# EAGLE design M129X (EAGLE 6.6.0)
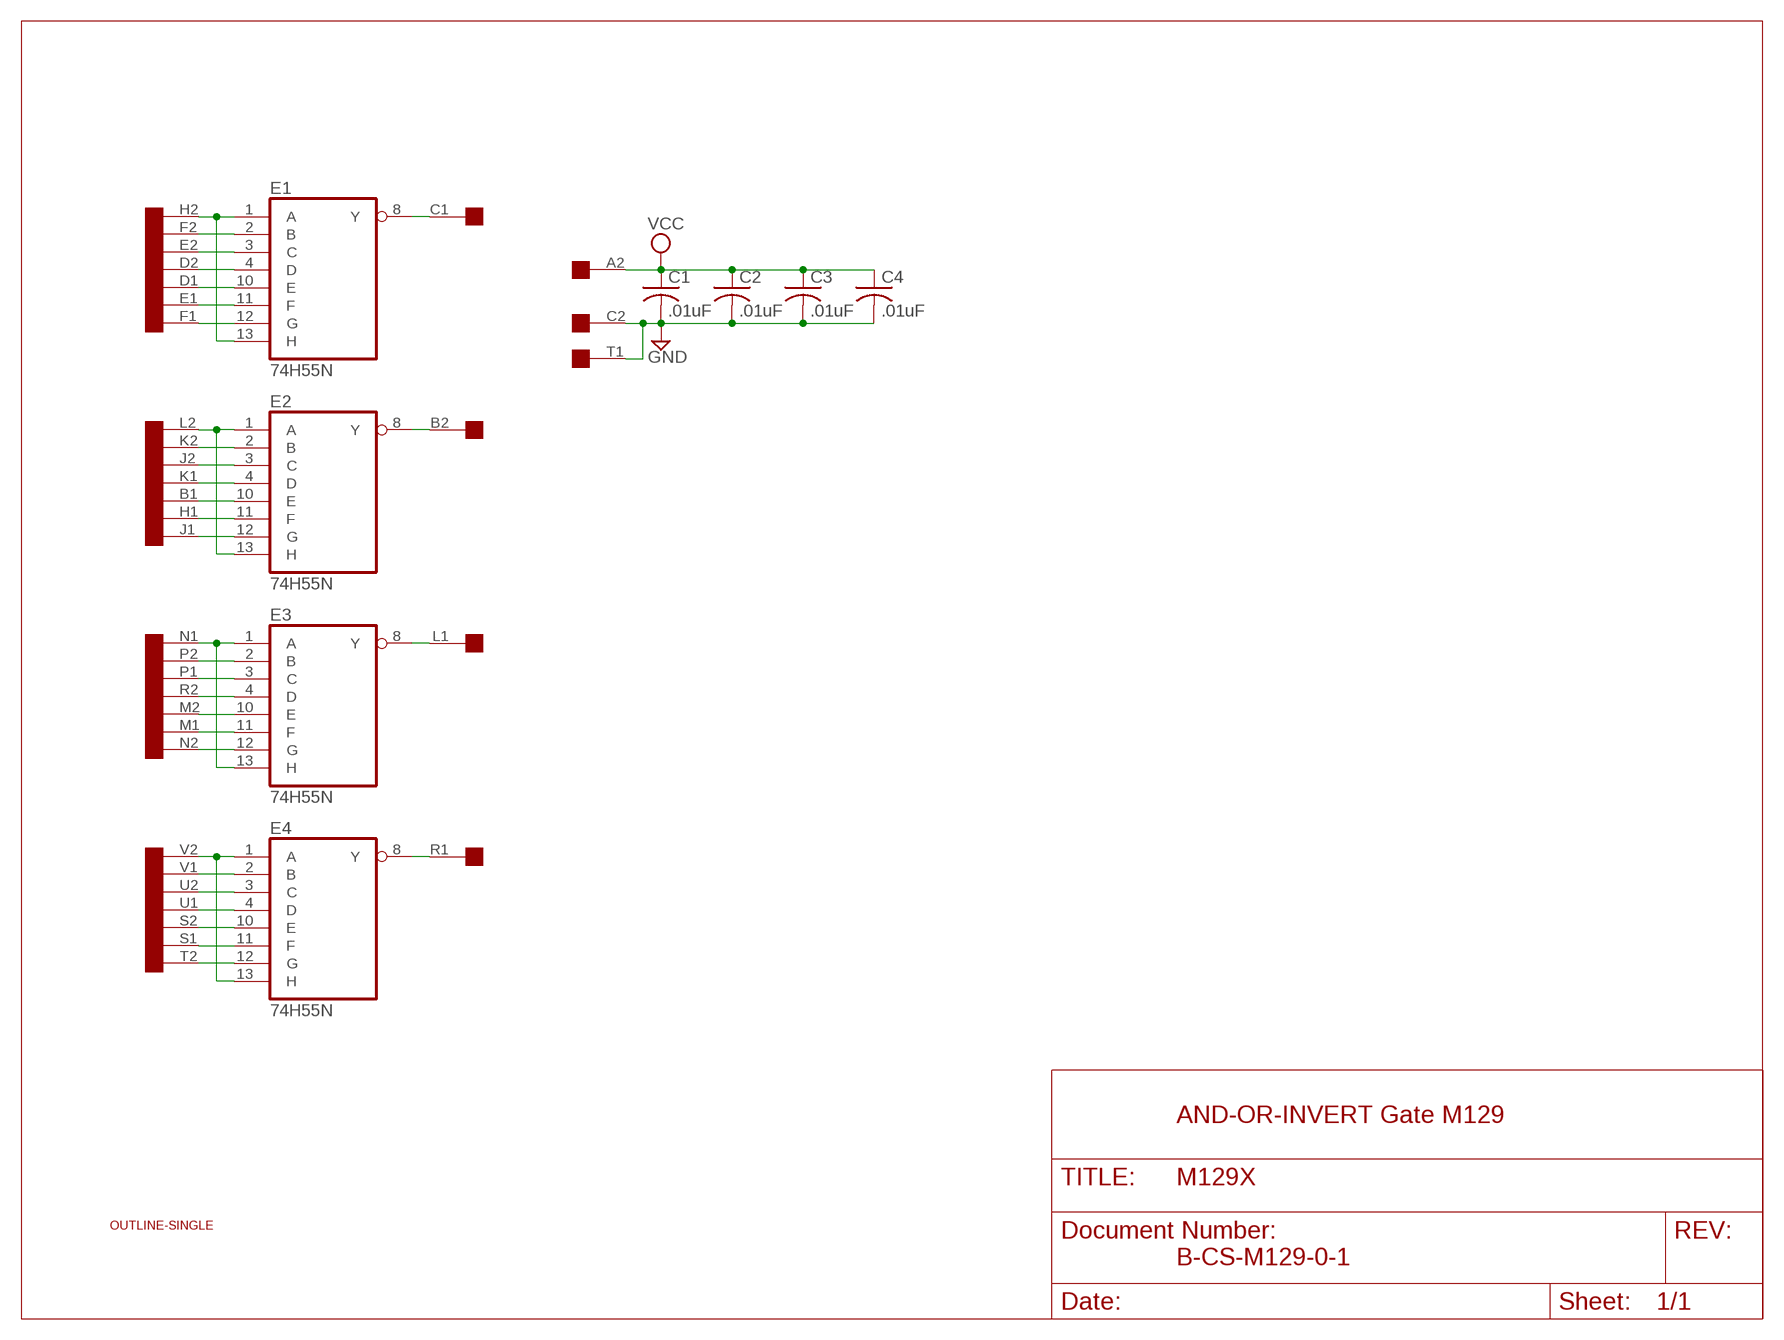
[diagram p0: schematic, sheet 1]

## Parts
C1  .01uF  C-US050-025X075  [C050-025X075]
C2  .01uF  C-US050-025X075  [C050-025X075]
C3  .01uF  C-US050-025X075  [C050-025X075]
C4  .01uF  C-US050-025X075  [C050-025X075]
E1  74H55N  74LS55N  [DIL14]
E2  74H55N  74LS55N  [DIL14]
E3  74H55N  74LS55N  [DIL14]
E4  74H55N  74LS55N  [DIL14]
U$1  SINGLE  [EDGE-CON2]
U$2  OUTLINE-SINGLE  [SINGLE]

## Nets
B1: E2.10(E) U$1.B1
B2: E2.8(Y) U$1.B2
C1: E1.8(Y) U$1.C1
D1: E1.10(E) U$1.D1
D2: E1.4(D) U$1.D2
E1: E1.11(F) U$1.E1
E2: E1.3(C) U$1.E2
F1: E1.12(G) U$1.F1
F2: E1.2(B) U$1.F2
GND: C1.2 C2.2 C3.2 C4.2 U$1.C2 U$1.T1
H1: E2.11(F) U$1.H1
H2: E1.1(A) E1.13(H) U$1.H2
J1: E2.12(G) U$1.J1
J2: E2.3(C) U$1.J2
K1: E2.4(D) U$1.K1
K2: E2.2(B) U$1.K2
L1: E3.8(Y) U$1.L1
L2: E2.1(A) E2.13(H) U$1.L2
M1: E3.11(F) U$1.M1
M2: E3.10(E) U$1.M2
N1: E3.1(A) E3.13(H) U$1.N1
N2: E3.12(G) U$1.N2
P1: E3.3(C) U$1.P1
P2: E3.2(B) U$1.P2
R1: E4.8(Y) U$1.R1
R2: E3.4(D) U$1.R2
S1: E4.11(F) U$1.S1
S2: E4.10(E) U$1.S2
T2: E4.12(G) U$1.T2
U1: E4.4(D) U$1.U1
U2: E4.3(C) U$1.U2
V1: E4.2(B) U$1.V1
V2: E4.1(A) E4.13(H) U$1.V2
VCC: C1.1 C2.1 C3.1 C4.1 U$1.A2
Unconnected: U$1.A1

## Notes on the sheet
- AND-OR-INVERT Gate M129
- B-CS-M129-0-1

## Power pins joined to a net without a drawn wire
GND: E1.7(GND) E2.7(GND) E3.7(GND) E4.7(GND)
VCC: E1.14(VCC) E2.14(VCC) E3.14(VCC) E4.14(VCC)

## Library data of the parts
C1-C4 = rcl:C-US: CAPACITOR, American symbol
E1-E4 = 74xx-us:74*55: 2-wide 4-input AND OR INVERTER gate
U$1 = dec-con:SINGLE: Single-Height DEC board
U$2 = dec-con:OUTLINE-*: Board outlines for DEC boards.

## Net classes
0 default: width 0.813 mm

## Board
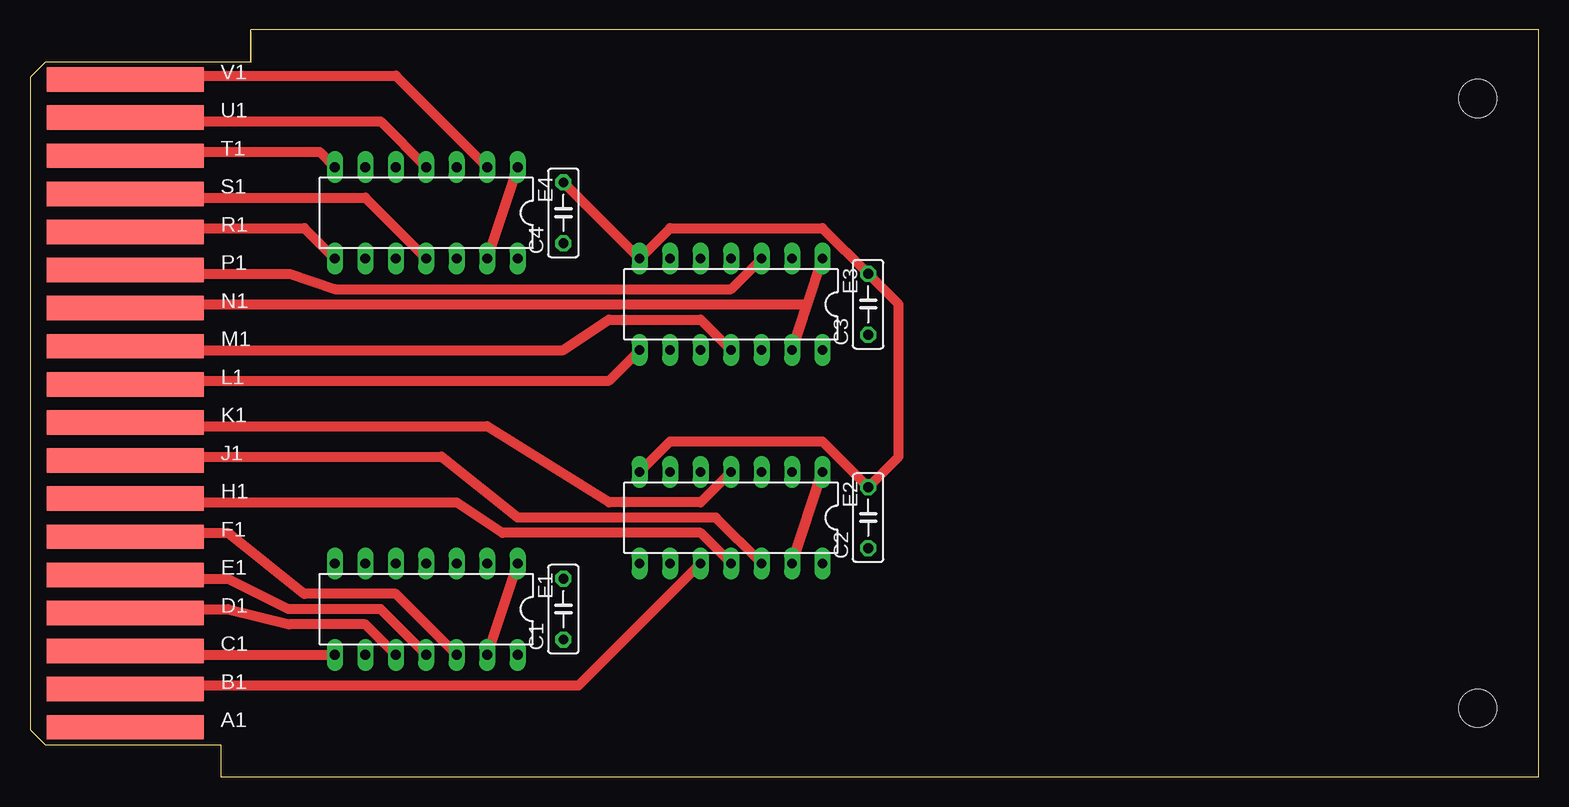
[diagram p1: board, top side]
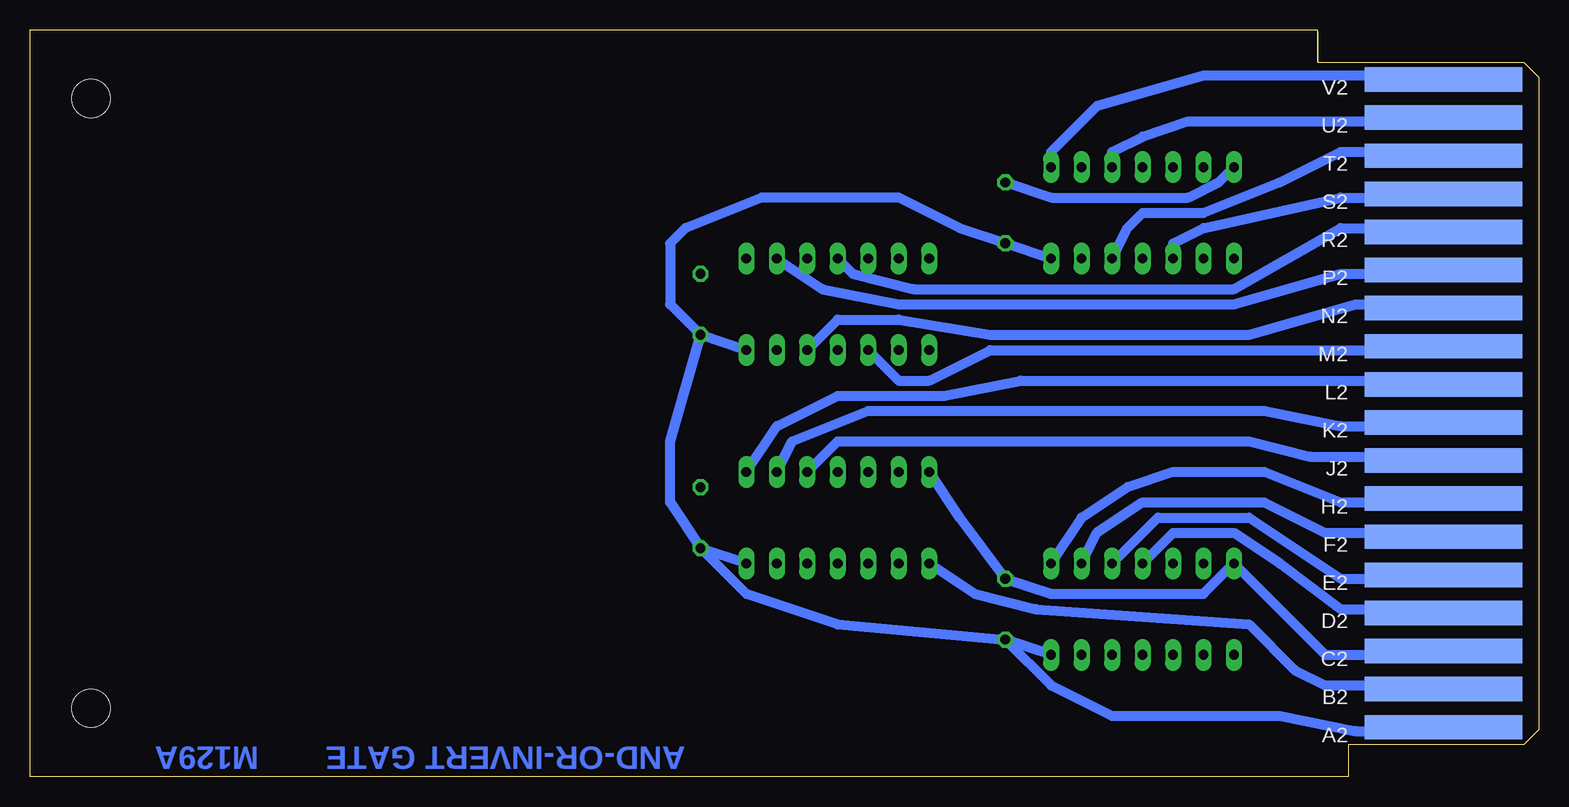
[diagram p2: board, bottom side, seen from below]

Size 125.73 x 62.23 mm. Coordinates in mm from the lower left corner, seen from the top.
Copper layers (1+16): Top 0.035mm / dielectric 1.5mm / Bottom 0.035mm
Design rules "16mils": minimum track width 16mil, minimum drill 32mil, track to track 15mil, track to pad 10mil, pad to pad 10mil, via to via 10mil, smd to smd 10mil, copper to edge 13mil, drill to drill 10mil, minimum pad ring 10mil, minimum via ring 8mil, stop-mask expansion 0mil, vias tented up to drill 0mil, thermal gap 10mil

### Footprints (pad centres in the part's own frame; a part is rotated, then mirrored left to right if it is on the bottom)
C050-025X075 = drill 0.813 octagon: 1 -2.54,0; 2 2.54,0
DIL14 = drill 0.813 long: 1 -7.62,-3.81; 2 -5.08,-3.81; 3 -2.54,-3.81; 4 0,-3.81; 5 2.54,-3.81; 6 5.08,-3.81; 7 7.62,-3.81; 8 7.62,3.81; 9 5.08,3.81; 10 2.54,3.81; 11 0,3.81; 12 -2.54,3.81; 13 -5.08,3.81; 14 -7.62,3.81
EDGE-CON2 = smd 13.106 x 2.032: A1 7.938,4.128; B1 7.938,7.303; C1 7.938,10.477; D1 7.938,13.652; E1 7.938,16.828; F1 7.938,20.003; H1 7.938,23.177; J1 7.938,26.352; K1 7.938,29.527; L1 7.938,32.703; M1 7.938,35.877; N1 7.938,39.053; P1 7.938,42.227; R1 7.938,45.403; S1 7.938,48.578; T1 7.938,51.752; U1 7.938,54.928; V1 7.938,58.102 | smd 13.106 x 2.032 bottom: A2 7.938,4.128; B2 7.938,7.303; C2 7.938,10.477; D2 7.938,13.652; E2 7.938,16.828; F2 7.938,20.003; H2 7.938,23.177; J2 7.938,26.352; K2 7.938,29.527; L2 7.938,32.703; M2 7.938,35.877; N2 7.938,39.053; P2 7.938,42.227; R2 7.938,45.403; S2 7.938,48.578; T2 7.938,51.752; U2 7.938,54.928; V2 7.938,58.102
SINGLE = hole 3.175: 120.65,56.515; 120.65,5.715

### Placement (x,y rotation side)
C1  44.45,13.97 90 top
C2  69.85,21.59 90 top
C3  69.85,39.37 90 top
C4  44.45,46.99 90 top
E1  33.02,13.97 180 top
E2  58.42,21.59 180 top
E3  58.42,39.37 180 top
E4  33.02,46.99 180 top
U$1  0,0 0 top
U$2  0,0 0 top

### Tracks (layer width: path | path; a pad name or v marks a point on that pad's centre or on a via)
B1
  Top 0.813: U$1.B1 8.89,7.62 45.72,7.62 E2.10
B2
  Bottom 0.813: E2.8 46.99,15.24 41.91,13.97 24.13,12.7 20.32,8.89 17.78,7.62 8.89,7.62 U$1.B2
C1
  Top 0.813: U$1.C1 7.62,10.16 E1.8
D1
  Top 0.813: E1.10 27.94,12.7 21.59,12.7 16.51,13.97 8.89,13.97 U$1.D1
D2
  Bottom 0.813: E1.4 30.48,20.32 25.4,20.32 21.59,17.78 16.51,13.97 8.89,13.97 U$1.D2
E1
  Top 0.813: E1.11 29.21,13.97 21.59,13.97 16.51,16.51 8.89,16.51 U$1.E1
E2
  Bottom 0.813: E1.3 31.75,21.59 24.13,21.59 16.51,16.51 8.89,16.51 U$1.E2
F1
  Top 0.813: E1.12 30.48,15.24 22.86,15.24 16.51,20.32 10.16,20.32 U$1.F1
F2
  Bottom 0.813: E1.2 36.83,20.32 33.02,22.86 22.86,22.86 17.78,20.32 8.89,20.32 U$1.F2
GND
  Top 0.813: U$1.T1 7.62,52.07 24.13,52.07 E4.7 | C4.2 E3.7 53.34,45.72 66.04,45.72 C3.2 72.39,39.37 72.39,26.67 C2.2 66.04,27.94 53.34,27.94 E2.7
  Bottom 0.813: U$1.C2 8.89,10.16 17.78,10.16 E1.7 27.94,15.24 40.64,15.24 C1.2 48.26,21.59 E2.7 | C4.2 40.64,48.26 29.21,48.26 26.67,49.53 E4.7
H1
  Top 0.813: E2.11 55.88,20.32 39.37,20.32 35.56,22.86 8.89,22.86 U$1.H1
H2
  Top 0.813: E1.13 E1.1
  Bottom 0.813: E1.1 38.1,21.59 34.29,24.13 30.48,25.4 22.86,25.4 16.51,22.86 8.89,22.86 U$1.H2
J1
  Top 0.813: U$1.J1 8.89,26.67 34.29,26.67 40.64,21.59 57.15,21.59 E2.12
J2
  Bottom 0.813: E2.3 58.42,27.94 24.13,27.94 19.05,26.67 8.89,26.67 U$1.J2
K1
  Top 0.813: E2.4 55.88,22.86 48.26,22.86 38.1,29.21 8.89,29.21 U$1.K1
K2
  Bottom 0.813: E2.2 62.23,27.94 55.88,30.48 22.86,30.48 16.51,29.21 8.89,29.21 U$1.K2
L1
  Top 0.813: U$1.L1 10.16,33.02 48.26,33.02 E3.8
L2
  Top 0.813: E2.13 E2.1
  Bottom 0.813: E2.1 63.5,29.21 58.42,31.75 49.53,31.75 43.18,33.02 8.89,33.02 U$1.L2
M1
  Top 0.813: U$1.M1 10.16,35.56 44.45,35.56 48.26,38.1 55.88,38.1 E3.11
M2
  Bottom 0.813: E3.10 53.34,33.02 50.8,33.02 45.72,35.56 8.89,35.56 U$1.M2
N1
  Top 0.813: E3.1 64.77,39.37 | U$1.N1 8.89,39.37 64.77,39.37 | E3.13 64.77,39.37
N2
  Bottom 0.813: E3.12 58.42,38.1 53.34,38.1 45.72,36.83 24.13,36.83 15.24,39.37 8.89,39.37 U$1.N2
P1
  Top 0.813: U$1.P1 7.62,41.91 21.59,41.91 25.4,40.64 58.42,40.64 E3.3
P2
  Bottom 0.813: E3.2 59.69,40.64 53.34,39.37 25.4,39.37 16.51,41.91 8.89,41.91 U$1.P2
R1
  Top 0.813: U$1.R1 8.89,45.72 22.86,45.72 E4.8
R2
  Bottom 0.813: E3.4 57.15,41.91 52.07,40.64 25.4,40.64 16.51,45.72 8.89,45.72 U$1.R2
S1
  Top 0.813: U$1.S1 8.89,48.26 27.94,48.26 E4.11
S2
  Bottom 0.813: E4.10 30.48,44.45 27.94,45.72 16.51,48.26 8.89,48.26 U$1.S2
T2
  Bottom 0.813: E4.12 34.29,45.72 33.02,46.99 27.94,46.99 21.59,49.53 16.51,52.07 8.89,52.07 U$1.T2
U1
  Top 0.813: U$1.U1 8.89,54.61 29.21,54.61 E4.4
U2
  Bottom 0.813: E4.3 35.56,52.07 33.02,53.34 29.21,54.61 8.89,54.61 U$1.U2
V1
  Top 0.813: U$1.V1 8.89,58.42 30.48,58.42 E4.2
V2
  Top 0.813: E4.13 E4.1
  Bottom 0.813: U$1.V2 10.16,58.42 27.94,58.42 36.83,55.88 40.64,52.07 E4.1
VCC
  Bottom 0.813: C1.1 40.64,7.62 35.56,5.08 21.59,5.08 15.24,3.81 8.89,3.81 U$1.A2 | C2.1 66.04,15.24 58.42,12.7 C1.1 | C2.1 72.39,22.86 72.39,27.94 C3.1 | C3.1 72.39,39.37 72.39,44.45 71.12,45.72 64.77,48.26 53.34,48.26 48.26,45.72 C4.1 E4.14 | E2.14 C2.1 | E1.14 C1.1 | E3.14 C3.1

### Text on the board
Bottom: AND-OR-INVERT GATE | M129A